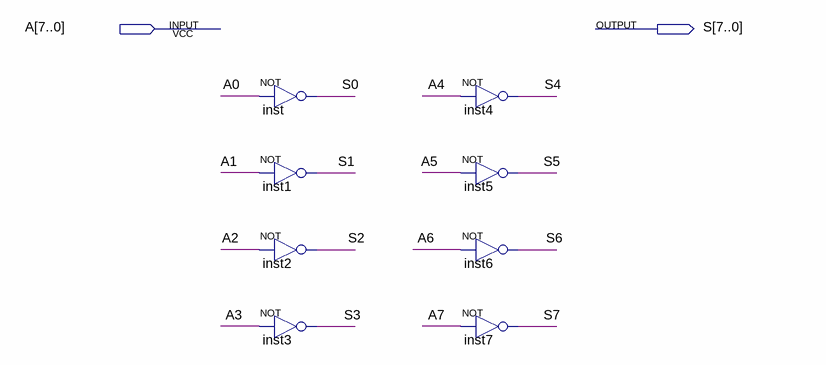
[diagram p0: schematic sheet]
// Quartus schematic NOT_end.bdf as structural Verilog: 8 symbols, 2 pins
module NOT_end (
  input  [7:0] A,
  output [7:0] S
);

  not inst (S[0], A[0]);
  not inst1 (S[1], A[1]);
  not inst2 (S[2], A[2]);
  not inst3 (S[3], A[3]);
  not inst4 (S[4], A[4]);
  not inst5 (S[5], A[5]);
  not inst6 (S[6], A[6]);
  not inst7 (S[7], A[7]);
endmodule
